# EAGLE design untitled (EAGLE 5.10)
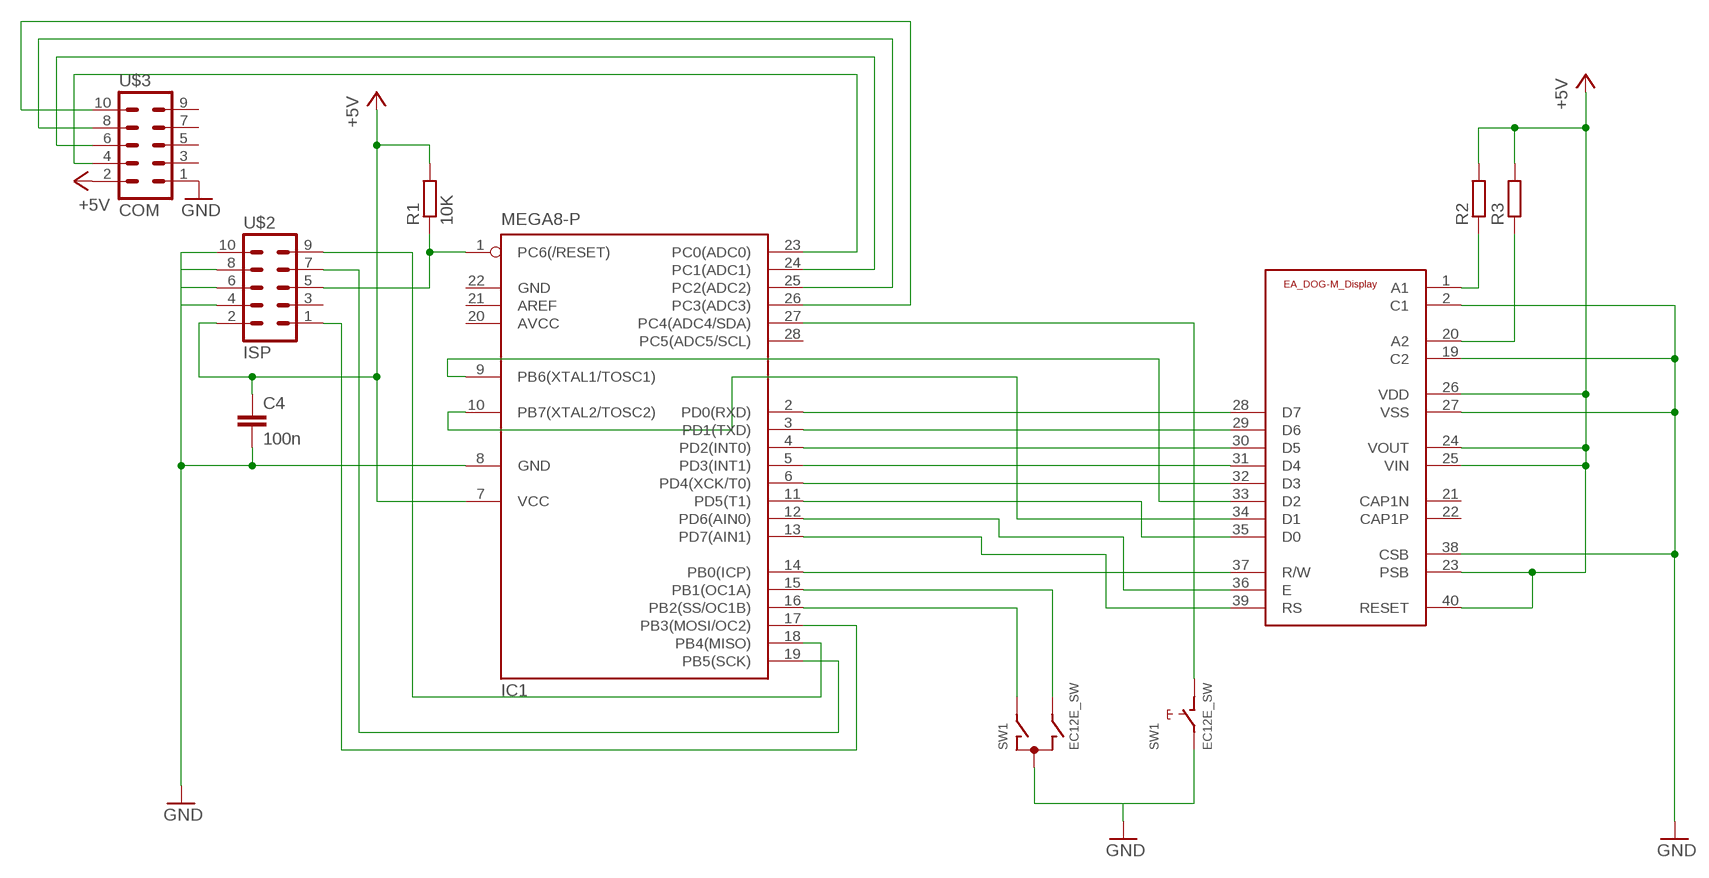
[diagram p0: schematic, sheet 1]

## Parts
C4  100n  C-EUC0805  [C0805]
IC1  MEGA8-P  [DIL28-3]
R1  10K  R-EU_0207/15  [0207/15]
R2  R-EU_R1206  [R1206]
R3  R-EU_R1206  [R1206]
SW1  EC12E_SW  [ALPS_EC12E_SW]
U$1  EA_DOG-M_DISPLAY  [E_DOG-M_DISPLAY]
U$2  ISP  ML10_SMD_GEBOGEN  [ML10L_GEKNICKT]
U$3  COM  ML10_SMD_GEBOGEN  [ML10L_GEKNICKT]

## Nets
+5V: C4.1 IC1.7(VCC) R1.2 R2.2 R3.2 U$1.23(PSB) U$1.24(VOUT) U$1.25(VIN) U$1.26(VDD) U$1.40(RESET) U$2.2 U$3.2
GND: C4.2 IC1.8(GND) SW1.C SW1.E U$1.2(C1) U$1.19(C2) U$1.27(VSS) U$1.38(CSB) U$2.4 U$2.6 U$2.8 U$2.10 U$3.1
N$2: IC1.2(PD0(RXD)) U$1.28(D7)
N$3: R2.1 U$1.1(A1)
N$4: IC1.23(PC0(ADC0)) U$3.4
N$5: IC1.3(PD1(TXD)) U$1.29(D6)
N$6: IC1.4(PD2(INT0)) U$1.30(D5)
N$7: IC1.5(PD3(INT1)) U$1.31(D4)
N$8: IC1.6(PD4(XCK/T0)) U$1.32(D3)
N$9: IC1.11(PD5(T1)) U$1.35(D0)
N$10: IC1.9(PB6(XTAL1/TOSC1)) U$1.33(D2)
N$11: IC1.12(PD6(AIN0)) U$1.36(E)
N$12: IC1.14(PB0(ICP)) U$1.37(R/W)
N$13: IC1.10(PB7(XTAL2/TOSC2)) U$1.34(D1)
N$14: IC1.13(PD7(AIN1)) U$1.39(RS)
N$16: IC1.1(PC6(/RESET)) R1.1 U$2.5
N$17: R3.1 U$1.20(A2)
N$18: IC1.17(PB3(MOSI/OC2)) U$2.1
N$19: IC1.18(PB4(MISO)) U$2.9
N$20: IC1.19(PB5(SCK)) U$2.7
N$26: IC1.24(PC1(ADC1)) U$3.6
N$27: IC1.25(PC2(ADC2)) U$3.8
N$28: IC1.26(PC3(ADC3)) U$3.10
N$29: IC1.15(PB1(OC1A)) SW1.B
N$30: IC1.16(PB2(SS/OC1B)) SW1.A
N$32: IC1.27(PC4(ADC4/SDA)) SW1.D
Unconnected: IC1.21(AREF) IC1.28(PC5(ADC5/SCL)) SW1.GND1(G) SW1.GND2(G) U$1.21(CAP1N) U$1.22(CAP1P) U$2.3 U$3.3 U$3.5 U$3.7 U$3.9

## Power pins joined to a net without a drawn wire
AVCC: IC1.20(AVCC)
GND: IC1.22(GND)

## Library data of the parts
C4 = rcl:C-EU: CAPACITOR, European symbol
IC1 = atmel:MEGA8-P: MICROCONTROLLER 8 Kbytes FLASH, 1 kbytes SRAM, 512 bytes EEPROM, USART, 4-channel 10 bit ADC, 2-channel 8 bit ADC Pin compatible with Atmega48, ATMega88, ATMega168 Source: avr.lbr
R1-R3 = rcl:R-EU_: RESISTOR, European symbol
SW1 = switch-alps:EC12E_SW: ALPS rotary Encoder EC12E series with switch
U$1 = display_ea_dog-m:EA_DOG-M_DISPLAY
U$2 U$3 = con-harting-ml:ML10_SMD_GEBOGEN

## Board
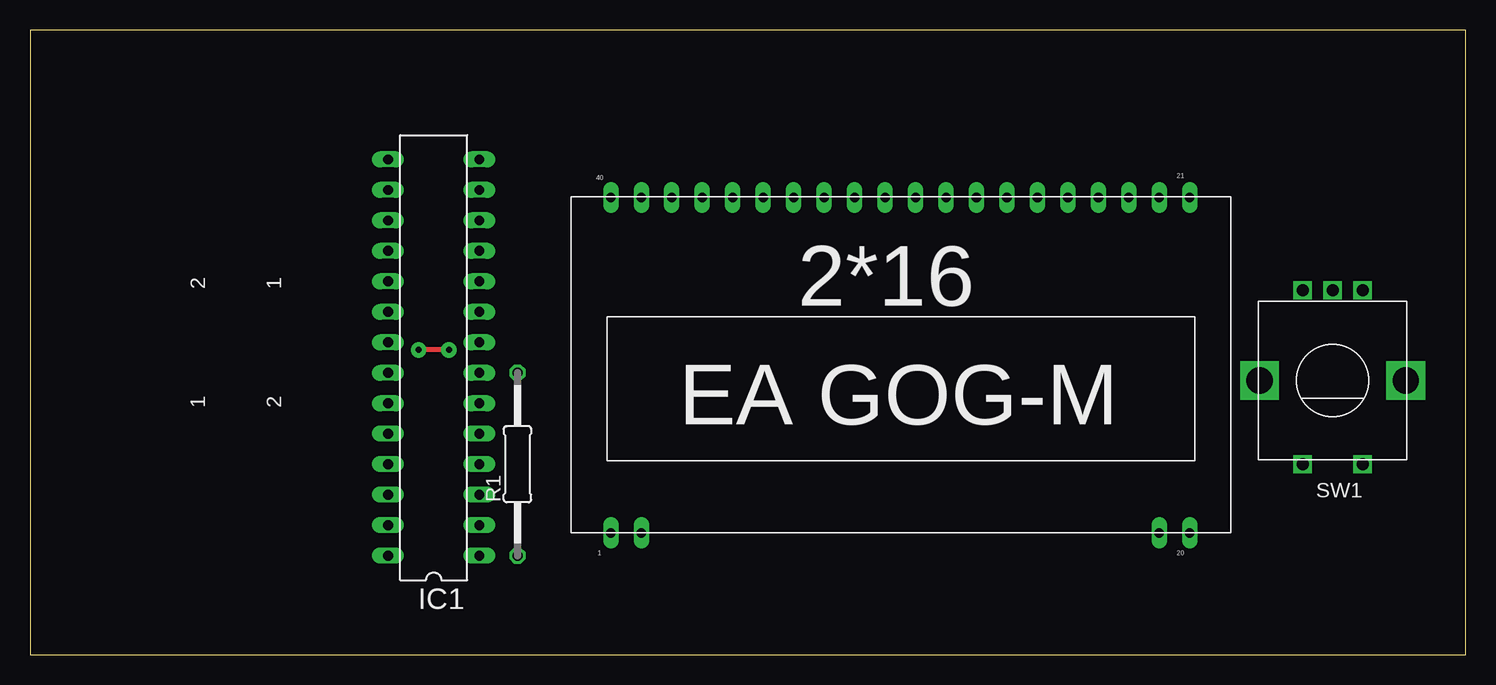
[diagram p1: board, top side]
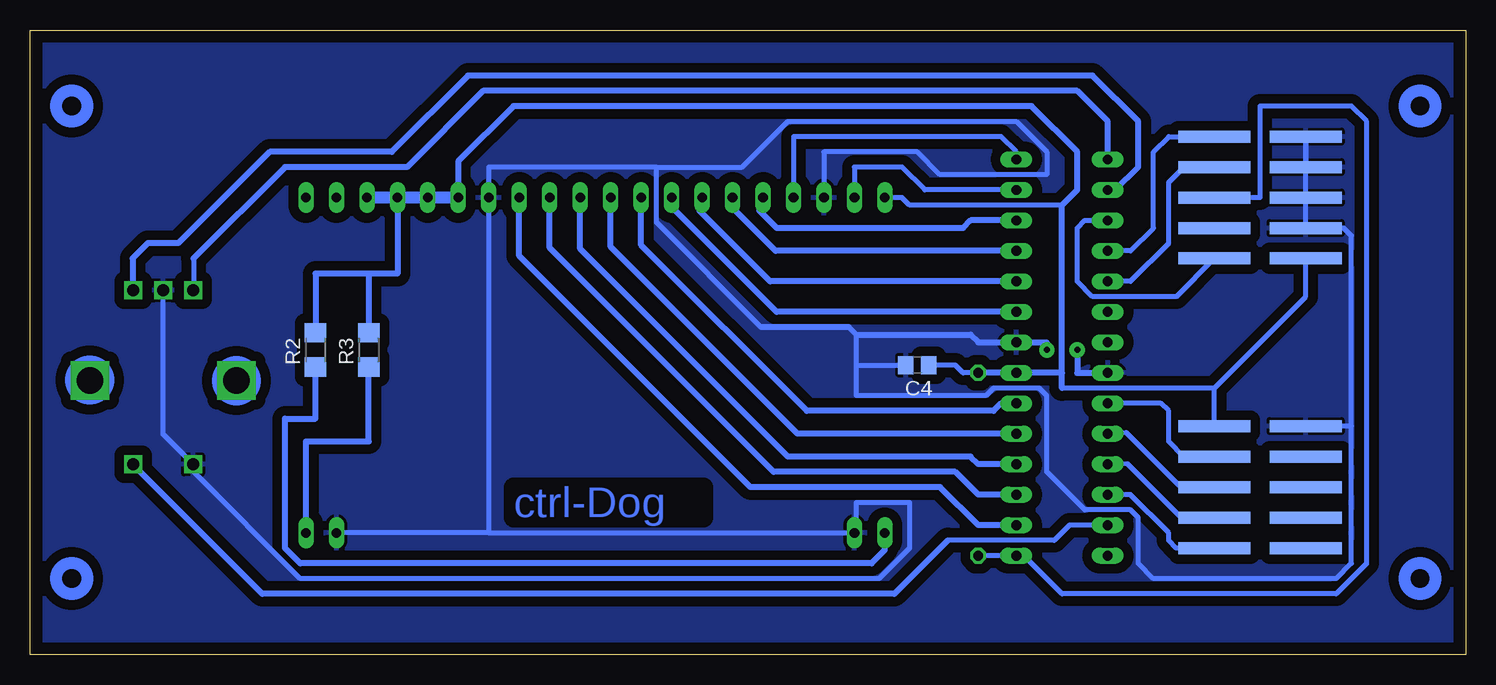
[diagram p2: board, bottom side, seen from below]

Size 119.69 x 52.06 mm. Coordinates in mm from the lower left corner, seen from the top.
Outline: 0,0 119.69,0 119.69,52.06 0,52.06 0,0
Copper layers (1*16): Top 0.035mm / dielectric 1.5mm / Bottom 0.035mm
Design rules "default": minimum track width 10mil, minimum drill 24mil, track to track 8mil, track to pad 8mil, pad to pad 8mil, via to via 8mil, smd to smd 8mil, copper to edge 40mil, drill to drill 8mil, minimum pad ring 10mil, minimum via ring 8mil, stop-mask expansion 4mil, vias tented up to drill 0mil, thermal gap 10mil

### Footprints (pad centres in the part's own frame; a part is rotated, then mirrored left to right if it is on the bottom)
C0805 = smd 1.3 x 1.5: 1 -0.95,0; 2 0.95,0
DIL28-3 = drill 0.813 long: 1 -16.51,-3.81; 2 -13.97,-3.81; 3 -11.43,-3.81; 4 -8.89,-3.81; 5 -6.35,-3.81; 6 -3.81,-3.81; 7 -1.27,-3.81; 8 1.27,-3.81; 9 3.81,-3.81; 10 6.35,-3.81; 11 8.89,-3.81; 12 11.43,-3.81; 13 13.97,-3.81; 14 16.51,-3.81; 15 16.51,3.81; 16 13.97,3.81; 17 11.43,3.81; 18 8.89,3.81; 19 6.35,3.81; 20 3.81,3.81; 21 1.27,3.81; 22 -1.27,3.81; 23 -3.81,3.81; 24 -6.35,3.81; 25 -8.89,3.81; 26 -11.43,3.81; 27 -13.97,3.81; 28 -16.51,3.81
0207/15 = drill 0.813 octagon: 1 -7.62,0; 2 7.62,0
R1206 = smd 1.6 x 1.803: 1 -1.422,0; 2 1.422,0
ALPS_EC12E_SW = drill 1 square: A -2.5,-7.5; B 2.5,-7.5; C 0,-7.5; D -2.5,7; E 2.5,7 | drill 2.2 square: GND1 -6.1,0; GND2 6.1,0
E_DOG-M_DISPLAY = drill 0.8 long: 1 3.334,0; 2 5.874,0; 19 49.054,0; 20 51.594,0; 21 51.594,27.94; 22 49.054,27.94; 23 46.514,27.94; 24 43.974,27.94; 25 41.434,27.94; 26 38.894,27.94; 27 36.354,27.94; 28 33.814,27.94; 29 31.274,27.94; 30 28.734,27.94; 31 26.194,27.94; 32 23.654,27.94; 33 21.114,27.94; 34 18.574,27.94; 35 16.034,27.94; 36 13.494,27.94; 37 10.954,27.94; 38 8.414,27.94; 39 5.874,27.94; 40 3.334,27.94
ML10L_GEKNICKT = smd 1 x 6 bottom: 1 -5.08,-3.81; 2 -5.08,3.81; 3 -2.54,-3.81; 4 -2.54,3.81; 5 0,-3.81; 6 0,3.81; 7 2.54,-3.81; 8 2.54,3.81; 9 5.08,-3.81; 10 5.08,3.81

### Placement (x,y rotation side)
C4  45.72,24.13 180 bottom
IC1  33.66,24.77 90 top
R1  40.64,15.88 90 top
R2  95.88,25.4 90 bottom
R3  91.44,25.4 90 bottom
SW1  108.59,22.86 180 top
U$1  45.09,10.16 0 top
U$2  17.14,38.1 90 top
U$3  17.14,13.97 270 top

### Tracks (layer width: path | path; a pad name or v marks a point on that pad's centre or on a via)
+5V
  Bottom 0.406: U$1.40 46.99,38.1 46.36,37.47 33.66,37.47 | R1.2 41.91,23.5 42.55,24.13 C4.1 | 20.96,22.23 33.66,22.23 | U$3.2 20.96,22.23 | U$2.2 13.34,29.84 20.96,22.23
  Bottom 0.508: R1.2 IC1.7 33.66,23.5 | 33.66,23.5 33.66,37.47 32.39,38.73 32.39,41.91 36.2,45.72 79.38,45.72 83.98,41.12 U$1.26 | 33.66,22.23 33.66,23.5 | 91.44,31.75 R3.2 | 91.44,31.75 95.88,31.75 R2.2 | U$1.24 89.06,31.75 91.44,31.75
  Bottom 1.016: U$1.26 U$1.25 U$1.24 U$1.23
GND  (via drill 0.5 pad 1.27)
  Top 0.406: v34.92,25.4 v32.39,25.4
  Bottom 0.406: U$1.38 53.5,41.91 45.72,41.91 43.81,40.01 34.92,40.01 34.92,41.91 37.47,44.45 56.52,44.45 60.33,40.64 67.47,40.64 | 51.44,27.3 50.8,26.67 50.8,24.13 | 67.47,40.64 81.44,40.64 U$1.27 81.44,10.16 | 58.75,27.3 67.47,36.03 67.47,40.64 | 81.44,10.16 U$1.2 50.8,10.16 50.8,12.7 46.36,12.7 46.36,8.89 48.9,6.35 97.16,6.35 106.04,15.24 106.04,15.82 SW1.E 108.59,18.36 SW1.C | 81.44,10.16 U$1.19 | 50.8,24.13 50.8,21.59 40.01,21.59 39.37,22.23 35.56,22.23 34.92,21.59 34.92,15.24 31.75,12.06 27.94,12.06 27.3,11.43 27.3,7.62 26.04,6.35 10.8,6.35 9.53,7.62 9.53,19.05 | 50.8,24.13 C4.2 | U$2.4 U$2.6 U$2.8 U$2.10 U$2.4 | U$3.1 10.8,19.05 9.53,19.05 | U$2.4 10.16,35.56 9.53,34.92 9.53,19.05
  Bottom 0.508: 50.8,26.67 41.28,26.67 40.64,26.04 IC1.8 34.92,26.04 v34.92,25.4 | 51.44,27.3 58.75,27.3 | IC1.22 32.39,23.5 v32.39,25.4
  pour Bottom (isolate 0.813): 0.64,0 0.64,52.07 118.75,52.07 118.75,0
N$2
  Bottom 0.508: IC1.2 40.64,10.79 43.81,13.97 59.63,13.97 78.9,33.24 U$1.28
N$3
  Bottom 0.508: U$1.1 48.42,8.73 49.53,7.62 97.16,7.62 98.43,8.89 98.43,19.68 95.88,19.68 R2.1
N$4
  Bottom 0.406: IC1.23 25.4,20.95 24.77,20.32 24.77,17.78 23.5,16.51 U$3.4
N$5
  Bottom 0.508: IC1.3 40.64,13.34 42.55,15.24 57.7,15.24 76.36,33.9 U$1.29
N$6
  Bottom 0.508: IC1.4 40.64,15.88 41.28,16.51 56.51,16.51 73.82,33.82 U$1.30
N$7
  Bottom 0.508: IC1.5 55.71,18.41 71.28,33.99 U$1.31
N$8
  Bottom 0.508: IC1.6 38.73,20.95 39.37,20.32 54.92,20.32 68.74,34.14 U$1.32
N$9
  Bottom 0.508: IC1.11 57.53,33.66 60.88,37 60.88,37.86 U$1.35
N$10
  Bottom 0.508: IC1.9 57.45,28.57 65.88,37 65.88,37.78 U$1.33
N$11
  Bottom 0.508: IC1.12 41.28,36.2 41.91,35.56 57.44,35.56 58.88,37 58.88,37.8 U$1.36
N$12
  Bottom 0.406: IC1.14 37.47,41.91 38.73,43.18 56.04,43.18 U$1.37
N$13
  Bottom 0.508: IC1.10 57.99,31.11 63.88,37 63.88,37.88 U$1.34
N$14
  Bottom 0.406: IC1.13 45.09,38.73 46.99,40.64 50.96,40.64 U$1.39
N$15  (via drill 0.5 pad 1.27)
  other vias: 32.39,25.4
N$16
  Bottom 0.406: R1.1 IC1.1 36.83,8.26 33.66,5.08 10.8,5.08 8.26,7.62 8.26,44.45 9.53,45.72 17.14,45.72 17.14,38.1 U$2.5
N$17
  Bottom 0.508: U$1.20 96.68,17.78 91.44,17.78 R3.1
N$18
  Bottom 0.406: IC1.17 31.75,36.2 32.39,35.56 32.39,31.11 31.12,29.84 24.13,29.84 U$2.1
N$19
  Bottom 0.406: IC1.18 27.94,33.66 26.04,35.56 26.04,41.91 24.77,43.18 U$2.9
N$20
  Bottom 0.406: IC1.19 27.94,31.11 24.77,34.29 24.77,39.37 23.5,40.64 U$2.7
N$21  (via drill 0.5 pad 1.27)
  other vias: 34.92,25.4
N$26
  Bottom 0.406: U$3.6 23.86,14.07 28.3,18.51 IC1.24
N$27
  Bottom 0.406: U$3.8 23.76,11.46 28.2,15.91 IC1.25
N$28
  Bottom 0.406: U$3.10 24.13,8.89 24.77,9.53 24.77,10.16 27.94,13.34 IC1.26
N$29
  Bottom 0.406: 106.04,33.02 106.04,30.4
  Bottom 0.508: IC1.15 29.85,44.45 32.39,46.99 81.91,46.99 88.27,40.64 98.43,40.64 106.04,33.02 | 106.04,30.4 SW1.B
N$30
  Bottom 0.406: 111.12,30.4 SW1.A
  Bottom 0.508: IC1.16 29.21,38.73 27.3,40.64 27.3,44.45 31.12,48.26 83.19,48.26 89.53,41.91 99.69,41.91 107.31,34.29 109.85,34.29 111.12,33.02 111.12,30.4
N$32
  Bottom 0.406: 111.09,15.84 SW1.D | 43.18,9.53 34.29,9.53 33.02,10.79 IC1.27
  Bottom 0.508: 111.09,15.84 100.33,5.08 47.62,5.08 43.18,9.53
(copper drawn outside any net)
  shapes: Bottom circle x6

### Text on the board
Bottom: ctrl-Dog